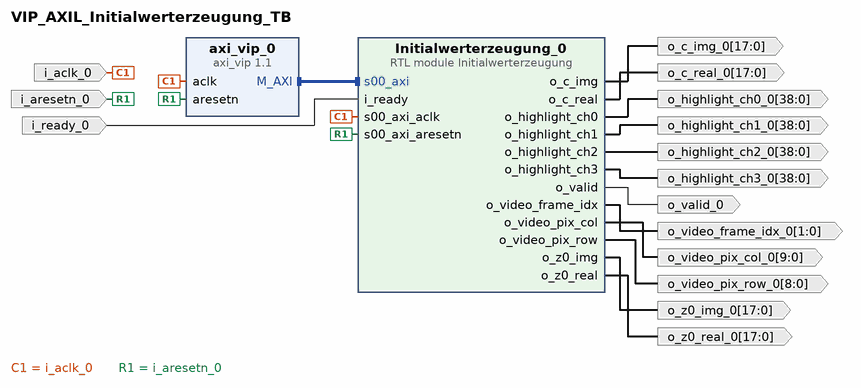
[diagram p0: block diagram of the top level]
# Vivado block design VIP_AXIL_Initialwerterzeugung_TB, xc7z020clg400-1, Vivado 2023.2
create_bd_design VIP_AXIL_Initialwerterzeugung_TB

create_bd_port -dir I -type clk i_aclk_0
create_bd_port -dir I -type rst i_aresetn_0
create_bd_port -dir I i_ready_0
create_bd_port -dir O o_valid_0
create_bd_port -dir O -from 9 -to 0 o_video_pix_col_0
create_bd_port -dir O -from 8 -to 0 o_video_pix_row_0
create_bd_port -dir O -from 1 -to 0 o_video_frame_idx_0
create_bd_port -dir O -from 17 -to 0 o_z0_real_0
create_bd_port -dir O -from 17 -to 0 o_z0_img_0
create_bd_port -dir O -from 17 -to 0 o_c_real_0
create_bd_port -dir O -from 17 -to 0 o_c_img_0
create_bd_port -dir O -from 38 -to 0 o_highlight_ch0_0
create_bd_port -dir O -from 38 -to 0 o_highlight_ch1_0
create_bd_port -dir O -from 38 -to 0 o_highlight_ch2_0
create_bd_port -dir O -from 38 -to 0 o_highlight_ch3_0

create_bd_cell -type ip -vlnv xilinx.com:ip:axi_vip:1.1 axi_vip_0
set_property -dict [list \
  CONFIG.ADDR_WIDTH 32 \
  CONFIG.DATA_WIDTH 32 \
  CONFIG.HAS_BRESP 1 \
  CONFIG.HAS_PROT 1 \
  CONFIG.HAS_RRESP 1 \
  CONFIG.HAS_WSTRB 1 \
  CONFIG.INTERFACE_MODE MASTER \
  CONFIG.PROTOCOL AXI4LITE \
  CONFIG.READ_WRITE_MODE READ_WRITE \
] [get_bd_cells axi_vip_0]
create_bd_cell -type module -reference Initialwerterzeugung Initialwerterzeugung_0

# ---- connections ----

connect_bd_intf_net [get_bd_intf_pins axi_vip_0/M_AXI] [get_bd_intf_pins Initialwerterzeugung_0/s00_axi]
connect_bd_net [get_bd_pins Initialwerterzeugung_0/o_c_img] [get_bd_ports o_c_img_0]
connect_bd_net [get_bd_pins Initialwerterzeugung_0/o_c_real] [get_bd_ports o_c_real_0]
connect_bd_net [get_bd_pins Initialwerterzeugung_0/o_highlight_ch0] [get_bd_ports o_highlight_ch0_0]
connect_bd_net [get_bd_pins Initialwerterzeugung_0/o_highlight_ch1] [get_bd_ports o_highlight_ch1_0]
connect_bd_net [get_bd_pins Initialwerterzeugung_0/o_highlight_ch2] [get_bd_ports o_highlight_ch2_0]
connect_bd_net [get_bd_pins Initialwerterzeugung_0/o_highlight_ch3] [get_bd_ports o_highlight_ch3_0]
connect_bd_net [get_bd_pins Initialwerterzeugung_0/o_valid] [get_bd_ports o_valid_0]
connect_bd_net [get_bd_pins Initialwerterzeugung_0/o_video_frame_idx] [get_bd_ports o_video_frame_idx_0]
connect_bd_net [get_bd_pins Initialwerterzeugung_0/o_video_pix_col] [get_bd_ports o_video_pix_col_0]
connect_bd_net [get_bd_pins Initialwerterzeugung_0/o_video_pix_row] [get_bd_ports o_video_pix_row_0]
connect_bd_net [get_bd_pins Initialwerterzeugung_0/o_z0_img] [get_bd_ports o_z0_img_0]
connect_bd_net [get_bd_pins Initialwerterzeugung_0/o_z0_real] [get_bd_ports o_z0_real_0]
connect_bd_net -net aclk_0_1 [get_bd_ports i_aclk_0] [get_bd_pins axi_vip_0/aclk] [get_bd_pins Initialwerterzeugung_0/s00_axi_aclk]
connect_bd_net -net aresetn_0_1 [get_bd_ports i_aresetn_0] [get_bd_pins axi_vip_0/aresetn] [get_bd_pins Initialwerterzeugung_0/s00_axi_aresetn]
connect_bd_net -net i_ready_0_1 [get_bd_ports i_ready_0] [get_bd_pins Initialwerterzeugung_0/i_ready]

# ---- address map ----
assign_bd_address -offset 0x00000000 -range 4K -target_address_space [get_bd_addr_spaces axi_vip_0/Master_AXI] [get_bd_addr_segs Initialwerterzeugung_0/s00_axi/reg0]

validate_bd_design
save_bd_design
